# Altium project 3-) 85VAC-265VAC 6W 5V SMPS FLAYBACK.PrjPcb
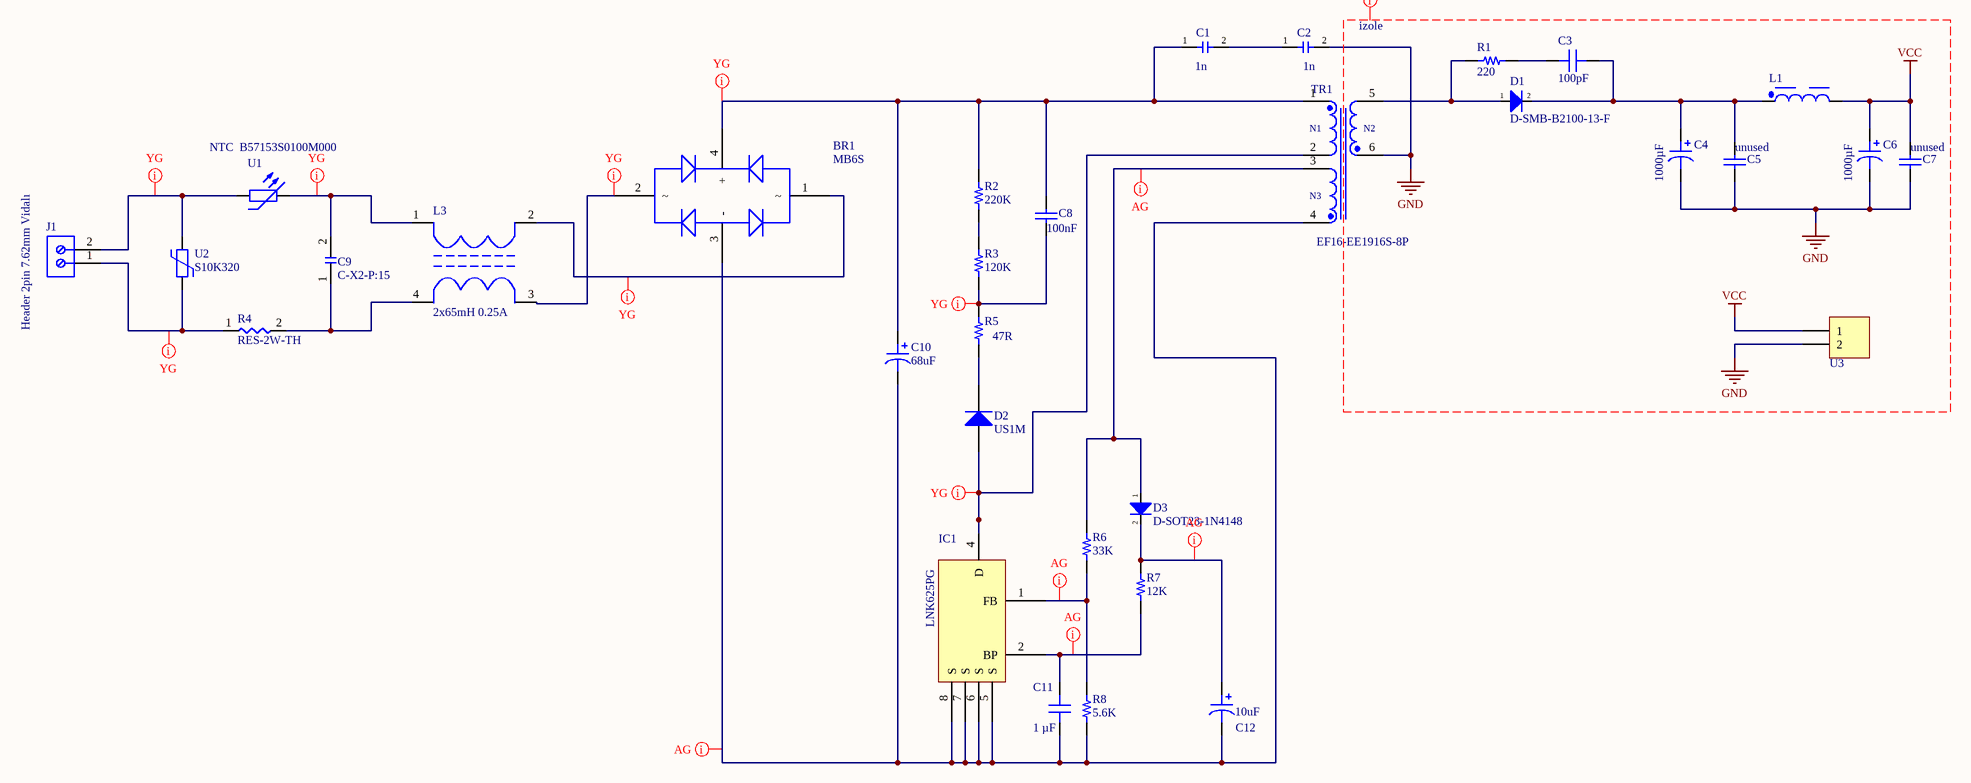
[diagram p0: 85VAC 265VAC 6W 5V SMPS FLAYBACK.SchDoc]
1 sheet, 32 parts. Net scope: global (net labels, ports and power ports of the same name join across sheets).
Board file: 85VAC-265VAC 6W 5V SMPS FLAYBACK.PcbDoc

## Sheet 85VAC 265VAC 6W 5V SMPS FLAYBACK.SchDoc
size A3; SheetNumber: 1; SheetTotal: 1; SPICEModelCacheFSSVWZHV: <root> / <DocumentId>FSSVWZHV</DocumentId> / <CacheFrame Number="0"> / <Model Name="5075_7447462102_1000u" Kind="CKT"> / <Text>******* / .subckt 5075_7447462102_1000u 1 2 / Rp 1 2 235800 / Cp 1 2 8.48p / Rs 1 N3 4.38 / L1 N3 2 1000u / .ends 5075_7447462102_1000u</Text> / </Model> / <Model Name="1206_885012008026_1nf" Kind="CKT"> / <Text>******* / .subckt 1206_885012008026_1nF 1 2 / Rser 1 3 0.0693861515837 / Lser 2 4 4.13253027E-10 / C1 3 4 0.000000001 / Rpar 3 4 10000000000 / .ends 1206_885012008026_1nF</Text> / </Model> / </CacheFrame> / </root>

### Parts
BR1  MB6S  [TO269AA]
C1  1n  [C-Y1-P:10]
C2  1n  [C-Y1-P:10]
C3  value 100pF  [CAP 1206_3216 - 0.8MM]
C4  Capacitance: 1000µF  [CAP TH ALUM ELEC D5.00mm S2.00mm H11.00mm]
C5  unused  [WCAP-CSGP_1206_L3.2W1.6H0.8]
C6  Capacitance: 1000µF  [CAP TH ALUM ELEC D5.00mm S2.00mm H11.00mm]
C7  unused  [WCAP-CSGP_1206_L3.2W1.6H0.8]
C8  100nF  [RCE7U2J333J5B1H03B]
C9  C-X2-P:15  [C-X2-P:15]
C10  68uF  [CAP TH ALUM ELEC D18.00mm S7.50mm H42.00mm]
C11  value 1 µF  [CAP 1206_3216 - 0.8MM]
C12  10uF  [CAP TH ALUM ELEC D6.30mm S2.50mm H6.00mm]
D1  D-SMB-B2100-13-F  [D-SMB-B2100-13-F]
D2  US1M  [DO-214AA(SMB)]
D3  D-SOT23-1N4148  [SOT23-3]
IC1  LNK625PG  [PDIP-8C]
J1  Header 2pin 7.62mm Vidalı  [Header 2 Pin 7.62mm Vidalı]
L1  1000uH, 0.25A  [WE-TI_5075]  (value not drawn)
L3  2x65mH 0.25A  [RN030923]
R1  220  [RES 1206_3216]
R2  220K  [RES 1206_3216]
R3  120K  [RES 1206_3216]
R4  RES-2W-TH  [RES-2W-TH]
R5  47R  [RES 1206_3216]
R6  33K  [RES 1206_3216]
R7  12K  [RES 1206_3216]
R8  5.6K  [RES 1206_3216]
TR1  EF16-EE1916S-8P  [EF16-EE1916S-8P]
U1  NTC  B57153S0100M000  [NTC B57153S0100]
U2  S10K320  [Varistor630V]
U3  Terminal Blok 2 Pin 2.54mm  [Header 2pin 2.54mm Vidalı]  (value not drawn)

### Nets
GND: C2.2 C4.2 C5.1 C6.2 C7.1 TR1.6 U3.2
VCC: C6.1 C7.2 L1.2 U3.1
NetBR1_1: BR1.1 L3.2
NetBR1_2: BR1.2 L3.3
NetBR1_3: BR1.3(-) C10.2 C11.1 C12.2 IC1.5(S) IC1.6(S) IC1.7(S) IC1.8(S) R8.1 TR1.4
NetBR1_4: BR1.4(+) C1.1 C8.2 C10.1 R2.2 TR1.1
NetC1_2: C1.2 C2.1
NetC3_1: C3.1 C4.1 C5.2 D1.2(A) L1.1
NetC3_2: C3.2 R1.1
NetC8_1: C8.1 R3.1 R5.2
NetC9_1: C9.1 L3.4 R4.2
NetC9_2: C9.2 L3.1 U1.2
NetC11_2: C11.2 IC1.2(BP) R7.1
NetC12_1: C12.1 D3.2(A) R7.2
NetD1_1: D1.1(A) R1.2 TR1.5
NetD2_1: D2.1(A) IC1.4(D) TR1.2
NetD2_2: D2.2(K) R5.1
NetD3_1: D3.1(A) R6.2 TR1.3
NetIC1_1: IC1.1(FB) R6.1 R8.2
NetJ1_1: J1.1 R4.1 U2.2
NetJ1_2: J1.2 U1.1 U2.1
NetR2_1: R2.1 R3.2

### Layout directives
net class izole: GND, VCC
net class YG: NetBR1_1, NetBR1_2, NetBR1_4, NetC8_1, NetC9_2, NetD2_1, NetJ1_1, NetJ1_2
net class AG: NetBR1_3, NetC11_2, NetC12_1, NetD3_1, NetIC1_1

### Notes on the sheet
- (in symbol EF16-EE1916S-8P) N1; N2; N3

### Library data of the parts
C1 C2 = C-Y1-P:10
C3 C11 = CC1206KKX7R8BB105: CAP CER 1UF 25V X7R 1206; Part Number: CC1206KKX7R8BB105
C4 C6 = UKT1E4R7MDD: CAP ALUM 1000UF 20% 25V RADIAL; manufacturer: Nichicon; Lifetime @ Temp.: 1000 Hrs @ 105°C; Polarization: Polar; Ripple Current @ High Frequency: 50mA @ 10kHz; Ripple Current @ Low Frequency: 25mA @ 120Hz; value: 4.7µF; Part Number: UKT1E4R7MDD; Applications: Audio; componentlink1description: Datasheet; componentlink1url: http://nichicon-us.com/english/products/pdfs/e-ukt.pdf; componentlink2description: DigiKey Link; componentlink2url: http://digikey.com/product-detail/en/nichicon/UKT1E4R7MDD/493-16320-ND/1964342; Device Package: Radial, Can; Height - Seated (Max): 0.433" (11.00mm); lastupdated: 4.09.2020 23:28:56; Lead Spacing: 0.079" (2.00mm); Lifecycle Status: Active; Minimum Order: 1; Mounting Type: Through Hole; Operating Temperature: -55°C ~ 105°C; Package / Case: Radial, Can; packaging: Bulk; partid: 21396; Part Status: Active; price: 0.34; series: UKT; Size / Dimension: 0.197" Dia (5.00mm); Supplier 1: DigiKey; Supplier Part Number 1: 493-16320-ND; Tolerance: ±20%; Voltage - Rated: 25V
C5 C7 = 885012008026: WCAP-CSGP Multilayer Ceramic Chip Capacitor, General Purpose, size 1206, NP0, 1nF, 25VDC; Manufacturer: Wurth Elektronik; Case/Size Code: 1206; Capacitance Tolerance: +/-5%; Insulation Resistance: 10GOhm; Q Factor: 1000; Rated Voltage (DC): 25V; Technical Reference: NP01206102J025DFCT10000; Manufacturer Part Number: 885012008026; Category: Multilayer Ceramic Chip Capacitors; Match Code: WCAP-CSGP; ComponentLink1Description: Website Link; ComponentLink1URL: https://www.we-online.com/redexpert/article/885012008026?ad; ComponentLink2Description: Datasheet Link; ComponentLink2URL: https://www.we-online.com/redexpert/spec/885012008026?ad; Mount: Surface Mount; Operating Temperature Max: 125°C; Operating Temperature Min: -55°C; Packaging: Tape and Reel; Length: 3.2mm; Width: 1.6mm; Height: 0.8mm; Capacitance: 1nF; Ceramic Type: NP0
C8 = C Seramik 100nF 1kV X7R 5mm: 490-8944-ND; Published: 8-Jun-2000; LatestRevisionDate: 17-Jul-2002; LatestRevisionNote: Re-released for DXP Platform.; PackageReference: RAD-0.3; Publisher: Altium Limited; PackageDescription: Radial Cap, Thru-Hole; 2 Leads; 0.3 in Pin Spacing
C9 = C-X2-P:15: CAP-X2-R15-17.5x7.5
C10 = EEU-EE2W680: CAP ALUM 68UF 20% 450V RADIAL; Part Number: EEU-EE2W680
C12 = UMA1H100MDD: CAP ALUM 10UF 20% 50V RADIAL; Part Number: UMA1H100MDD
D2 = US1M: SMA
J1 = Header 2pin 7.62mm Vidalı: 691214410002; Part Number: 691218410002; Compliance: Lead free / RoHS; Modularity: Yes; PCB/Cable/Panel: PCB; Pin Number: 2; Rated Current [UL]: 30A; Working Voltage [UL]: 300VAC; ComponentLink1Description: Manufacturer; ComponentLink1URL: http://www.we-online.de; ComponentLink2URL: https://katalog.we-online.de/em/datasheet/691218410002.pdf; ComponentLink2Description: Datasheet; Mounting Technology: THT; Packaging: Box; Operating Temperature: -40 to +105degC; Pitch: 7.62mm; Published Date: October 2019; Type: Horizontal; Publisher: Wurth Elektronik; Application: Rising Cage Clamp
L1 = 7447462102: WE-TI Radial Leaded Wire Wound Inductor, size 5075, 1000uH, 0.25A, 6Ohm; Manufacturer: Wurth Elektronik; Case/Size Code: 5075; DC Resistance: 4.38Ohm; Saturation Current: 0.27A; Self Resonant Frequency: 1.8MHz; Manufacturer Part Number: 7447462102; Category: Power Inductors; Match Code: WE-TI; ComponentLink1Description: Website Link; ComponentLink1URL: https://www.we-online.com/redexpert/article/7447462102?ad; ComponentLink2Description: Datasheet Link; ComponentLink2URL: https://www.we-online.com/redexpert/spec/7447462102?ad; Mount: Through Hole; Operating Temperature Max: 125°C; Operating Temperature Min: -40°C; Packaging: Tray; Height: 8.5mm; Diameter: 6mm; DC Resistance Max: 6Ohm; Inductance: 1000uH; Rated Current: 0.25A
L3 = 2x65mH 0.25A: Line Filter RN030923
R1 R3 R6 = RMCF1206JT120K: RES 120K OHM 5% 1/4W 1206; Part Number: RMCF1206JT120K
R2 = RT1206BRD07220KL: RES SMD 220K OHM 0.1% 1/4W 1206; Part Number: RT1206BRD07220KL
R5 = AC1206JR-0747RL: RES SMD 47 OHM 5% 1/4W 1206; Part Number: AC1206JR-0747RL
R7 = RMCF1206JT120K: RES 12K OHM 5% 1/4W 1206; Part Number: RMCF1206JT120K
R8 = RMCF1206JT120K: RES 5.6K OHM 5% 1/4W 1206; Part Number: RMCF1206JT120K
U1 = NTC 10R 2A 8.5mm: 495-2076-ND; Published: 8-Jun-2000; LatestRevisionDate: 17-Jul-2002; LatestRevisionNote: Re-released for DXP Platform.; PackageReference: AXIAL-0.4; Publisher: Altium Limited; PackageDescription: Axial Device, Thru-Hole; 2 Leads; 0.4 in Pin Spacing
U2 = Varistor S10K320: Published: 8-Jun-2000; LatestRevisionDate: 17-Jul-2002; LatestRevisionNote: Re-released for DXP Platform.; PackageReference: AXIAL-0.4; Publisher: Altium Limited; PackageDescription: Axial Device, Thru-Hole; 2 Leads; 0.4 in Pin Spacing
U3 = Header 2 Pin 2.54mm Vidalı: 691210910002; LatestRevisionDate: 17-Jul-2002; LatestRevisionNote: Re-released for DXP Platform.; Publisher: Altium Limited